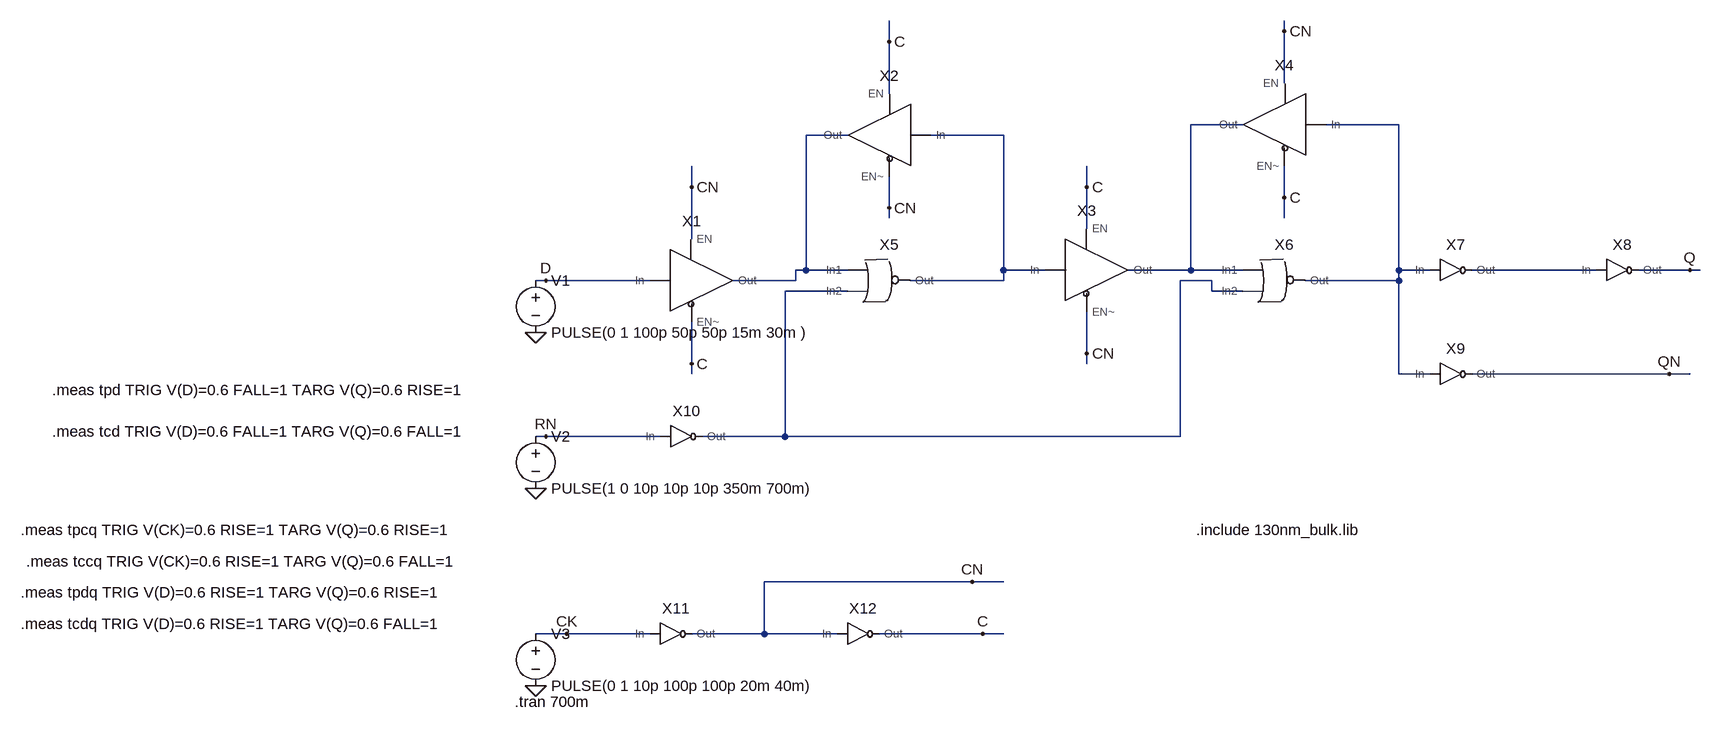
[diagram p0: schematic FFD_Reset.asc]
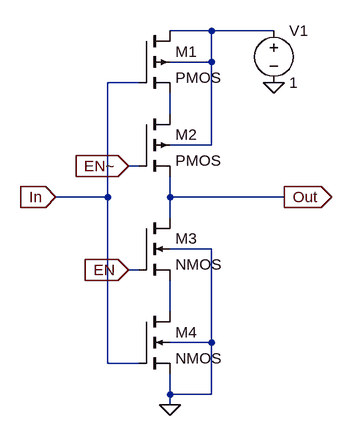
[diagram p1: sub-circuit tristate.asc]
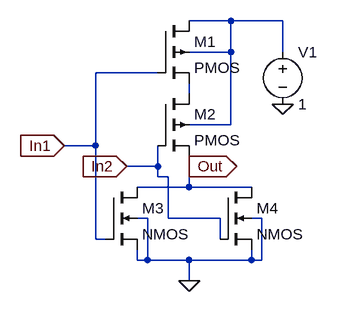
[diagram p2: sub-circuit nor2.asc]
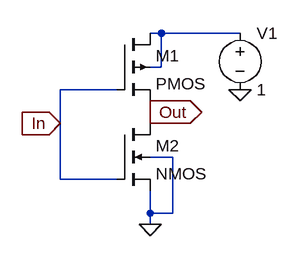
[diagram p3: sub-circuit not.asc]
FFD_Reset.asc, the LTspice schematic file:
Version 4
SHEET 1 1608 744
WIRE 928 -304 928 -320
WIRE 320 -288 320 -320
WIRE 928 -224 928 -304
WIRE 320 -208 320 -288
WIRE 864 -160 784 -160
WIRE 1104 -160 992 -160
WIRE 256 -144 192 -144
WIRE 496 -144 384 -144
WIRE 16 -64 16 -96
WIRE 624 -64 624 -96
WIRE 928 -48 928 -96
WIRE 320 -32 320 -80
WIRE 320 -16 320 -32
WIRE 928 -16 928 -48
WIRE 624 0 624 -64
WIRE 16 16 16 -64
WIRE 192 64 192 -144
WIRE 192 64 176 64
WIRE 256 64 192 64
WIRE 496 64 496 -144
WIRE 560 64 496 64
WIRE 784 64 784 -160
WIRE 784 64 688 64
WIRE 864 64 784 64
WIRE 1104 64 1104 -160
WIRE 1152 64 1104 64
WIRE 1408 64 1216 64
WIRE 1552 64 1472 64
WIRE 1568 64 1552 64
WIRE -208 80 -224 80
WIRE -48 80 -208 80
WIRE 176 80 176 64
WIRE 176 80 80 80
WIRE 496 80 496 64
WIRE 496 80 352 80
WIRE 816 80 768 80
WIRE 1104 80 1104 64
WIRE 1104 80 960 80
WIRE 256 96 160 96
WIRE 816 96 816 80
WIRE 864 96 816 96
WIRE 624 192 624 128
WIRE 16 208 16 144
WIRE 624 208 624 192
WIRE 16 224 16 208
WIRE 1104 224 1104 80
WIRE 1152 224 1104 224
WIRE 1520 224 1216 224
WIRE 1552 224 1520 224
WIRE -208 320 -224 320
WIRE -32 320 -208 320
WIRE 160 320 160 96
WIRE 160 320 32 320
WIRE 768 320 768 80
WIRE 768 320 160 320
WIRE 448 544 128 544
WIRE 496 544 448 544
WIRE -176 624 -224 624
WIRE -48 624 -176 624
WIRE 128 624 128 544
WIRE 128 624 16 624
WIRE 240 624 128 624
WIRE 464 624 304 624
WIRE 496 624 464 624
FLAG -208 80 D
FLAG -208 320 RN
FLAG -176 624 CK
FLAG 448 544 CN
FLAG 464 624 C
FLAG 1552 64 Q
FLAG 1520 224 QN
FLAG 16 208 C
FLAG 16 -64 CN
FLAG 320 -32 CN
FLAG 320 -288 C
FLAG 624 192 CN
FLAG 624 -64 C
FLAG 928 -304 CN
FLAG 928 -48 C
FLAG -224 160 0
FLAG -224 400 0
FLAG -224 704 0
SYMBOL TriState 16 80 R0
SYMATTR InstName X1
SYMBOL TriState 320 -144 M0
SYMATTR InstName X2
SYMBOL TriState 624 64 R0
SYMATTR InstName X3
SYMBOL TriState 928 -160 M0
SYMATTR InstName X4
SYMBOL Nor2 320 80 R0
SYMATTR InstName X5
SYMBOL Nor2 928 80 R0
SYMATTR InstName X6
SYMBOL Not 1184 64 R0
SYMATTR InstName X7
SYMBOL Not 1440 64 R0
SYMATTR InstName X8
SYMBOL Not 1184 224 R0
SYMATTR InstName X9
SYMBOL Not 0 320 R0
SYMATTR InstName X10
SYMBOL Not -16 624 R0
SYMATTR InstName X11
SYMBOL Not 272 624 R0
SYMATTR InstName X12
SYMBOL voltage -224 64 R0
WINDOW 123 0 0 Left 0
WINDOW 39 0 0 Left 0
SYMATTR InstName V1
SYMATTR Value PULSE(0 1 100p 50p 50p 15m 30m )
SYMBOL voltage -224 304 R0
WINDOW 123 0 0 Left 0
WINDOW 39 0 0 Left 0
SYMATTR InstName V2
SYMATTR Value PULSE(1 0 10p 10p 10p 350m 700m)
SYMBOL voltage -224 608 R0
WINDOW 123 0 0 Left 0
WINDOW 39 0 0 Left 0
SYMATTR InstName V3
SYMATTR Value PULSE(0 1 10p 100p 100p 20m 40m)
TEXT -256 728 Left 2 !.tran 700m
TEXT 792 464 Left 2 !.include 130nm_bulk.lib
TEXT -968 248 Left 2 !.meas tpd TRIG V(D)=0.6 FALL=1 TARG V(Q)=0.6 RISE=1
TEXT -968 312 Left 2 !.meas tcd TRIG V(D)=0.6 FALL=1 TARG V(Q)=0.6 FALL=1
TEXT -1016 464 Left 2 !.meas tpcq TRIG V(CK)=0.6 RISE=1 TARG V(Q)=0.6 RISE=1
TEXT -1008 512 Left 2 !.meas tccq TRIG V(CK)=0.6 RISE=1 TARG V(Q)=0.6 FALL=1
TEXT -1016 560 Left 2 !.meas tpdq TRIG V(D)=0.6 RISE=1 TARG V(Q)=0.6 RISE=1
TEXT -1016 608 Left 2 !.meas tcdq TRIG V(D)=0.6 RISE=1 TARG V(Q)=0.6 FALL=1

tristate.asc, the sub-circuit schematic file:
Version 4
SHEET 1 880 680
WIRE 288 48 224 48
WIRE 384 48 288 48
WIRE 288 96 288 48
WIRE 288 96 224 96
WIRE 176 128 128 128
WIRE 224 176 224 144
WIRE 288 224 288 96
WIRE 288 224 224 224
WIRE 176 256 160 256
WIRE 128 304 128 128
WIRE 128 304 48 304
WIRE 224 304 224 272
WIRE 400 304 224 304
WIRE 224 336 224 304
WIRE 288 384 224 384
WIRE 176 416 160 416
WIRE 224 480 224 432
WIRE 288 528 288 384
WIRE 288 528 224 528
WIRE 128 560 128 304
WIRE 176 560 128 560
WIRE 224 608 224 576
WIRE 288 608 288 528
WIRE 288 608 224 608
WIRE 224 624 224 608
FLAG 384 128 0
FLAG 224 624 0
FLAG 48 304 In
IOPIN 48 304 In
FLAG 400 304 Out
IOPIN 400 304 Out
FLAG 160 256 EN~
IOPIN 160 256 In
FLAG 160 416 EN
IOPIN 160 416 In
SYMBOL pmos4 176 48 R0
SYMATTR InstName M1
SYMATTR Value2 l=130n w=4u
SYMBOL pmos4 176 176 R0
SYMATTR InstName M2
SYMATTR Value2 l=130n w=4u
SYMBOL nmos4 176 336 R0
SYMATTR InstName M3
SYMATTR Value2 l=130n w=2u
SYMBOL nmos4 176 480 R0
SYMATTR InstName M4
SYMATTR Value2 l=130n w=2u
SYMBOL voltage 384 32 R0
WINDOW 123 0 0 Left 0
WINDOW 39 0 0 Left 0
SYMATTR InstName V1
SYMATTR Value 1

nor2.asc, the sub-circuit schematic file:
Version 4
SHEET 1 880 680
WIRE 288 48 224 48
WIRE 368 48 288 48
WIRE 288 96 288 48
WIRE 288 96 224 96
WIRE 368 96 368 48
WIRE 176 128 80 128
WIRE 224 160 224 144
WIRE 288 208 288 96
WIRE 288 208 224 208
WIRE 80 240 80 128
WIRE 80 240 32 240
WIRE 176 272 176 240
WIRE 176 272 128 272
WIRE 224 272 224 256
WIRE 176 288 176 272
WIRE 192 288 176 288
WIRE 224 304 224 272
WIRE 224 304 144 304
WIRE 320 304 224 304
WIRE 160 352 144 352
WIRE 192 352 192 288
WIRE 272 352 192 352
WIRE 336 352 320 352
WIRE 80 384 80 240
WIRE 96 384 80 384
WIRE 272 384 272 352
WIRE 144 416 144 400
WIRE 160 416 160 352
WIRE 160 416 144 416
WIRE 224 416 160 416
WIRE 320 416 320 400
WIRE 320 416 224 416
WIRE 336 416 336 352
WIRE 336 416 320 416
WIRE 224 448 224 416
FLAG 224 448 0
FLAG 368 176 0
FLAG 32 240 In1
IOPIN 32 240 In
FLAG 224 272 Out
IOPIN 224 272 Out
FLAG 128 272 In2
IOPIN 128 272 In
SYMBOL pmos4 176 48 R0
SYMATTR InstName M1
SYMATTR Value2 l=130n w=4u
SYMBOL pmos4 176 160 R0
SYMATTR InstName M2
SYMATTR Value2 l=130n w=4u
SYMBOL nmos4 96 304 R0
SYMATTR InstName M3
SYMATTR Value2 l=130n w=1u
SYMBOL nmos4 272 304 R0
SYMATTR InstName M4
SYMATTR Value2 l=130n w=1u
SYMBOL voltage 368 80 R0
WINDOW 123 0 0 Left 0
WINDOW 39 0 0 Left 0
SYMATTR InstName V1
SYMATTR Value 1

not.asc, the sub-circuit schematic file:
Version 4
SHEET 1 880 680
WIRE 240 48 224 48
WIRE 352 48 240 48
WIRE 240 96 240 48
WIRE 240 96 224 96
WIRE 176 128 96 128
WIRE 224 160 224 144
WIRE 96 176 96 128
WIRE 224 176 224 160
WIRE 256 224 224 224
WIRE 96 256 96 176
WIRE 176 256 96 256
WIRE 224 304 224 272
WIRE 256 304 256 224
WIRE 256 304 224 304
WIRE 224 320 224 304
FLAG 352 128 0
FLAG 224 320 0
FLAG 96 176 In
IOPIN 96 176 In
FLAG 224 160 Out
IOPIN 224 160 Out
SYMBOL pmos4 176 48 R0
SYMATTR InstName M1
SYMATTR Value2 l=130n w=2u
SYMBOL nmos4 176 176 R0
SYMATTR InstName M2
SYMATTR Value2 l=130n w=1u
SYMBOL voltage 352 32 R0
WINDOW 123 0 0 Left 0
WINDOW 39 0 0 Left 0
SYMATTR InstName V1
SYMATTR Value 1

The netlist it stands for:
* FFD_Reset.asc
XX1 CN C D N003 tristate
XX2 C CN N004 N003 tristate
XX3 C CN N004 N001 tristate
XX4 CN C N002 N001 tristate
XX5 N003 N006 N004 nor2
XX6 N001 N006 N002 nor2
XX7 N002 N005 not
XX8 N005 Q not
XX9 N002 QN not
XX10 RN N006 not
XX11 CK CN not
XX12 CN C not
V1 D 0 PULSE(0 1 100p 50p 50p 15m 30m )
V2 RN 0 PULSE(1 0 10p 10p 10p 350m 700m)
V3 CK 0 PULSE(0 1 10p 100p 100p 20m 40m)

* block symbol definitions
.subckt tristate EN EN~ In Out
M1 N001 In N002 N001 PMOS l=130n w=4u
M2 N002 EN~ Out N001 PMOS l=130n w=4u
M3 Out EN N003 0 NMOS l=130n w=2u
M4 N003 In 0 0 NMOS l=130n w=2u
V1 N001 0 1
.ends tristate

.subckt nor2 In1 In2 Out
M1 N001 In1 N002 N001 PMOS l=130n w=4u
M2 N002 In2 Out N001 PMOS l=130n w=4u
M3 Out In1 0 0 NMOS l=130n w=1u
M4 Out In2 0 0 NMOS l=130n w=1u
V1 N001 0 1
.ends nor2

.subckt not In Out
M1 N001 In Out N001 PMOS l=130n w=2u
M2 Out In 0 0 NMOS l=130n w=1u
V1 N001 0 1
.ends not

.model NMOS NMOS
.model PMOS PMOS
.lib standard.mos
.tran 700m
.include 130nm_bulk.lib
.meas tpd TRIG V(D)=0.6 FALL=1 TARG V(Q)=0.6 RISE=1
.meas tcd TRIG V(D)=0.6 FALL=1 TARG V(Q)=0.6 FALL=1
.meas tpcq TRIG V(CK)=0.6 RISE=1 TARG V(Q)=0.6 RISE=1
.meas tccq TRIG V(CK)=0.6 RISE=1 TARG V(Q)=0.6 FALL=1
.meas tpdq TRIG V(D)=0.6 RISE=1 TARG V(Q)=0.6 RISE=1
.meas tcdq TRIG V(D)=0.6 RISE=1 TARG V(Q)=0.6 FALL=1
.backanno
.end